# Altium schematic sheet 12V_5V@3.5A_SchDoc.SchDoc
size A4; SheetNumber: 1; SheetTotal: 1
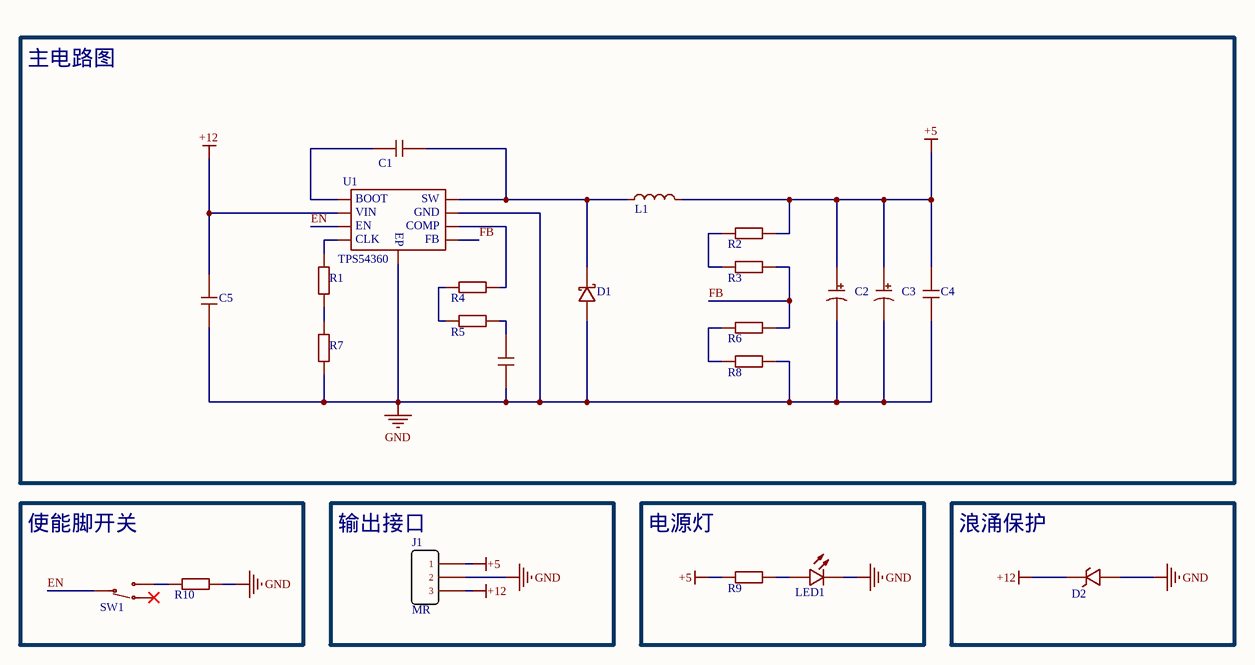
[diagram p0: 12V_5V@3.5A_SchDoc.SchDoc]

## Parts
?  680pF  [0603C]  (value not drawn)
C1  100nF  [0603C]  (value not drawn)
C2  47uF  [SVP6.3]  (value not drawn)
C3  NC  [3528B/1210]  (value not drawn)
C4  NC  [0805C]  (value not drawn)
C5  4.7uF  [0805C]  (value not drawn)
D1  SS56  [SMA]  (value not drawn)
D2  SMAJ12  [SMA]  (value not drawn)
J1  MR  [MR30-FB]
L1  3.3uH  [CD7X]  (value not drawn)
LED1  LED  [0603D]  (value not drawn)
R1  75k  [0603R]  (value not drawn)
R2  60.4k  [0603R]  (value not drawn)
R3  60.4kNC  [0603R]  (value not drawn)
R4  23.7k  [0603R]  (value not drawn)
R5  23.7kNC  [0603R]  (value not drawn)
R6  11.5k  [0603R]  (value not drawn)
R7  75kNC  [0603R]  (value not drawn)
R8  11.5kNC  [0603R]  (value not drawn)
R9  5k  [0603R]  (value not drawn)
R10  NC  [0603R]  (value not drawn)
SW1  开关  [*SW-1280S]  (value not drawn)
U1  TPS54360  [SOP-8-PP]

## Blocks framed on the sheet
主电路图: ? C1-C5 D1 L1 R1-R8 U1
使能脚开关: R10 SW1
输出接口: J1
电源灯: LED1 R9
浪涌保护: D2

## Nets
+5: C2.1 C3.1 C4.1 J1.1 L1.2 R2.2 R9.1
+12: C5.1 D2.2 J1.3 U1.2
GND: ?.1 C2.2 C3.2 C4.2 C5.2 D1.1 D2.1 J1.2 LED1.2 R7.1 R8.2 R10.1 U1.7 U1.9
EN: SW1.1 U1.3
FB: R3.2 R6.2 U1.5
Net?_2: ?.2 R5.1
NetC1_1: C1.1 U1.1
NetC1_2: C1.2 D1.2 L1.1 U1.8
NetLED1_1: LED1.1 R9.2
NetR1_1: R1.1 R7.2
NetR1_2: R1.2 U1.4
NetR2_1: R2.1 R3.1
NetR4_1: R4.1 U1.6
NetR4_2: R4.2 R5.2
NetR6_1: R6.1 R8.1
NetR10_2: R10.2 SW1.3

Not connected (* = marked no-connect by the designer): SW1 2*

## Notes on the sheet
- (in symbol 芯片/IC-TPS54360) BOOT; SW; VIN; GND; EN; COMP; EP; CLK; FB

## Library data of the parts
? C1 C4 C5 = 电容_贴片
C2 = 电容_贴片电解: 松下的！
C3 = 电容_贴片钽
D1 = 二极管_肖特基
D2 = 二极管_瞬态抑制
J1 = 接口_MR
L1 = 电感_贴片
LED1 = 二极管_贴片发光
R1-R10 = 电阻_贴片
SW1 = 开关_三脚
U1 = 芯片/IC-TPS54360